# EAGLE schematic mppt (EAGLE 9.6.2)

## Sheet 1 of 2
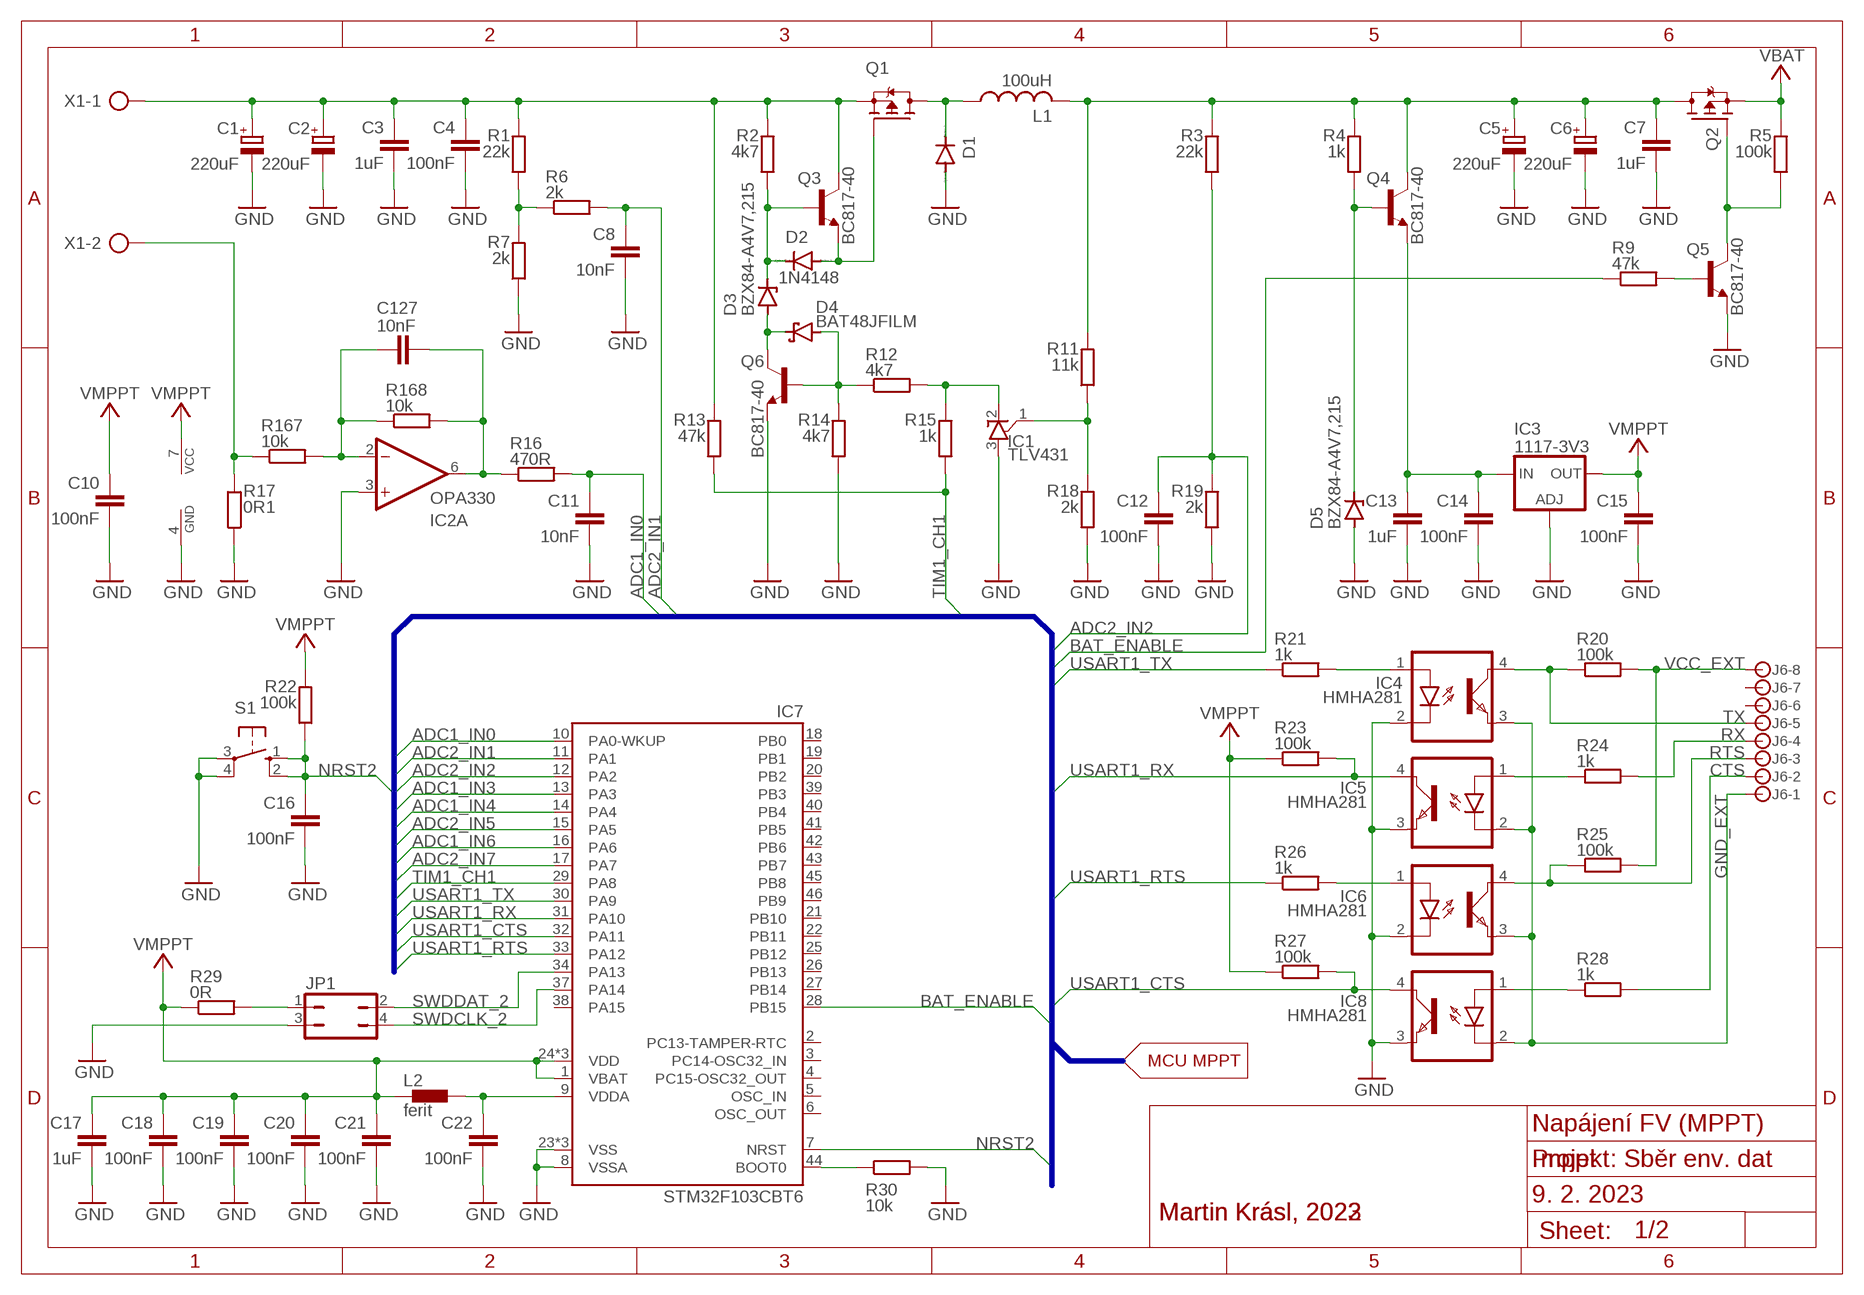
[diagram p0: schematic, sheet 1]

### Parts
C1  220uF  CPOL-EUG  [PANASONIC_G]
C2  220uF  CPOL-EUG  [PANASONIC_G]
C3  1uF  C-EUC0805  [C0805]
C4  100nF  C-EUC0402  [C0402]
C5  220uF  CPOL-EUG  [PANASONIC_G]
C6  220uF  CPOL-EUG  [PANASONIC_G]
C7  1uF  C-EUC0805  [C0805]
C8  10nF  C-EUC0402  [C0402]
C10  100nF  C-EUC0402  [C0402]
C11  10nF  C-EUC0402  [C0402]
C12  100nF  C-EUC0402  [C0402]
C13  1uF  C-EUC0805  [C0805]
C14  100nF  C-EUC0402  [C0402]
C15  100nF  C-EUC0402  [C0402]
C16  100nF  C-EUC0402  [C0402]
C17  1uF  C-EUC0805  [C0805]
C18  100nF  C-EUC0402  [C0402]
C19  100nF  C-EUC0402  [C0402]
C20  100nF  C-EUC0402  [C0402]
C21  100nF  C-EUC0402  [C0402]
C22  100nF  C-EUC0402  [C0402]
C127  10nF  C-EUC0402  [C0402]
D1  #?  1N4148  [SOD323]
D2  1N4148  [SOD323]
D3  BZX84-A4V7,215  ZENER-DIODESOT23  [SOT23]
D4  BAT48JFILM  BAT48  [SOD323]
D5  BZX84-A4V7,215  ZENER-DIODESOT23  [SOT23]
IC1  TLV431  [SOT23]
IC2  OPA330  OPA3  [SOIC-8]
IC3  1117-3V3  LD117AD2MTR  [D2PACK]
IC4  HMHA281  [SOIC127P680X239-4N]
IC5  HMHA281  [SOIC127P680X239-4N]
IC6  HMHA281  [SOIC127P680X239-4N]
IC7  STM32F103CBT6  [QFP50P900X900X160-48N]
IC8  HMHA281  [SOIC127P680X239-4N]
J6  JST-XH-8  [B8B-XH-A]
JP1  JP2Q  [JP2Q]
L1  100uH  L-USCEP125  [CEP125]
L2  ferit  BLM15HB121SN1  [0402]
Q1  #?  BSL207SP  [SC74_INFINEON]
Q2  #?  BSL207SP  [SC74_INFINEON]
Q3  BC817-40  BC817-16LT1SMD  [SOT23-BEC]
Q4  BC817-40  BC817-16LT1SMD  [SOT23-BEC]
Q5  BC817-40  BC817-16LT1SMD  [SOT23-BEC]
Q6  BC817-40  BC817-16LT1SMD  [SOT23-BEC]
R1  22k  R-EU_R0402  [R0402]
R2  4k7  R-EU_R0402  [R0402]
R3  22k  R-EU_R0402  [R0402]
R4  1k  R-EU_R0402  [R0402]
R5  100k  R-EU_R0402  [R0402]
R6  2k  R-EU_R0402  [R0402]
R7  2k  R-EU_R0402  [R0402]
R9  47k  R-EU_R0402  [R0402]
R11  11k  R-EU_R0402  [R0402]
R12  4k7  R-EU_R0402  [R0402]
R13  47k  R-EU_R0402  [R0402]
R14  4k7  R-EU_R0402  [R0402]
R15  1k  R-EU_R0402  [R0402]
R16  470R  R-EU_R0402  [R0402]
R17  0R1  R-EU_R0805  [R0805]
R18  2k  R-EU_R0402  [R0402]
R19  2k  R-EU_R0402  [R0402]
R20  100k  R-EU_R0402  [R0402]
R21  1k  R-EU_R0402  [R0402]
R22  100k  R-EU_R0402  [R0402]
R23  100k  R-EU_R0402  [R0402]
R24  1k  R-EU_R0402  [R0402]
R25  100k  R-EU_R0402  [R0402]
R26  1k  R-EU_R0402  [R0402]
R27  100k  R-EU_R0402  [R0402]
R28  1k  R-EU_R0402  [R0402]
R29  0R  R-EU_R0402  [R0402]
R30  10k  R-EU_R0402  [R0402]
R167  10k  R-EU_R0402  [R0402]
R168  10k  R-EU_R0402  [R0402]
S1  10-XX  [B3F-10XX]
X1  AK500/2  [AK500/2]

### Nets
ADC1_IN0: C11.1 IC7.10(PA0-WKUP) R16.2
ADC1_IN3: IC7.13(PA3) ; also sheet 2
ADC1_IN4: IC7.14(PA4) ; also sheet 2
ADC1_IN6: IC7.16(PA6) ; also sheet 2
ADC2_IN1: C8.1 IC7.11(PA1) R6.2
ADC2_IN2: C12.1 IC7.12(PA2) R3.1 R19.2
ADC2_IN5: IC7.15(PA5) ; also sheet 2
ADC2_IN7: IC7.17(PA7) ; also sheet 2
BAT_ENABLE: IC7.28(PB15) R9.1
CTS: J6.2 R28.2
GND: C1.- C2.- C3.2 C4.2 C5.- C6.- C7.2 C8.2 C10.2 C11.2 C12.2 C13.2 C14.2 C15.2 C16.2 C17.2 C18.2 C19.2 C20.2 C21.2 C22.2 D1.2(A) D5.1(A) IC1.3(A) IC2.3(A:+IN) IC2.4(P:GND) IC3.1(ADJ) IC4.2(K) IC5.3(E) IC6.2(K) IC7.8(VSSA) IC7.23(VSS) IC7.35(VSS) IC7.47(VSS) IC8.3(E) JP1.3 Q5.E Q6.E R7.1 R14.1 R17.1 R18.1 R19.1 R30.2 S1.3(P) S1.4(P1) ; also sheet 2
GND_EXT: IC4.3(E) IC5.2(K) IC6.3(E) IC8.2(K) J6.1
N$21: C127.1 IC2.2(A:-IN) R167.2 R168.1
N$22: C127.2 IC2.6(A:OUT) R16.1 R168.2
N$28: C13.1 C14.1 IC3.3(IN) Q4.E
N$67: C22.1 IC7.9(VDDA) L2.2
N$68: IC1.2(C) R12.2 R15.2
N$74: D5.3(C) Q4.B R4.1
N$75: Q5.B R9.2
N$79: R17.2 R167.1 X1.2
N$81: IC1.1(R) R11.1 R18.2
N$83: C5.+ C6.+ C7.1 L1.2 Q2.1(D) Q2.2(D) Q2.5(D) Q2.6(D) Q4.C R3.2 R4.2 R11.2
N$85: C1.+ C2.+ C3.1 C4.1 Q1.4(S) Q3.C R1.2 R2.2 R13.2 X1.1
N$86: D2.2(A) Q1.3(G) Q3.E
N$87: D2.1(C) D3.3(C) Q3.B R2.1
N$88: D3.1(A) D4.1(C) Q6.C
N$89: D4.2(A) Q6.B R12.1 R14.2
N$90: D1.1(C) L1.1 Q1.1(D) Q1.2(D) Q1.5(D) Q1.6(D)
N$93: Q2.3(G) Q5.C R5.1
N$96: R1.1 R6.1 R7.2
N$104: JP1.1 R29.2
N$106: IC7.44(BOOT0) R30.1
N$115: IC6.1(A) R26.2
N$118: IC4.1(A) R21.2
N$141: IC8.1(A) R28.1
N$143: IC5.1(A) R24.1
NRST2: C16.1 IC7.7(NRST) R22.1 S1.1(S) S1.2(S1)
RTS: IC6.4(C) J6.3 R25.1
RX: J6.4 R24.2
SWDCLK_2: IC7.37(PA14) JP1.4
SWDDAT_2: IC7.34(PA13) JP1.2
TIM1_CH1: IC7.29(PA8) R13.1 R15.1
TX: IC4.4(C) J6.5 R20.1
USART1_CTS: IC7.32(PA11) IC8.4(C) R27.2
USART1_RTS: IC7.33(PA12) R26.1
USART1_RX: IC5.4(C) IC7.31(PA10) R23.2
USART1_TX: IC7.30(PA9) R21.1
VBAT: Q2.4(S) R5.2 ; also sheet 2
VCC_EXT: J6.8 R20.2 R25.2
VMPPT: C10.1 C15.1 C17.1 C18.1 C19.1 C20.1 C21.1 IC2.7(P:VCC) IC3.2(OUT) IC7.1(VBAT) IC7.24(VDD) IC7.36(VDD) IC7.48(VDD) L2.1 R22.2 R23.1 R27.1 R29.1 ; also sheet 2
Unconnected: IC7.2(PC13-TAMPER-RTC) IC7.3(PC14-OSC32_IN) IC7.4(PC15-OSC32_OUT) IC7.5(OSC_IN) IC7.6(OSC_OUT) IC7.18(PB0) IC7.19(PB1) IC7.20(PB2) IC7.21(PB10) IC7.22(PB11) IC7.25(PB12) IC7.26(PB13) IC7.27(PB14) IC7.38(PA15) IC7.39(PB3) IC7.40(PB4) IC7.41(PB5) IC7.42(PB6) IC7.43(PB7) IC7.45(PB8) IC7.46(PB9) J6.6 J6.7

### Buses
ADC1_IN0,ADC1_IN3,ADC1_IN4,ADC1_IN6,ADC2_IN1,ADC2_IN2,ADC2_IN5,ADC2_IN7,BAT_ENABLE,NRST2,SYS_JTCK-SWCLK,SYS_JTMS-SWDIO,TIM1_CH1,USART1_CTS,USART1_RTS,USART1_RX,USART1_TX

### Notes on the sheet
- MCU MPPT
- Napájení FV (MPPT)
- Projekt: Sběr env. dat
- 9. 2. 2023
- Martin Krásl, 2022 | Martin Krásl, 2023

## Sheet 2 of 2
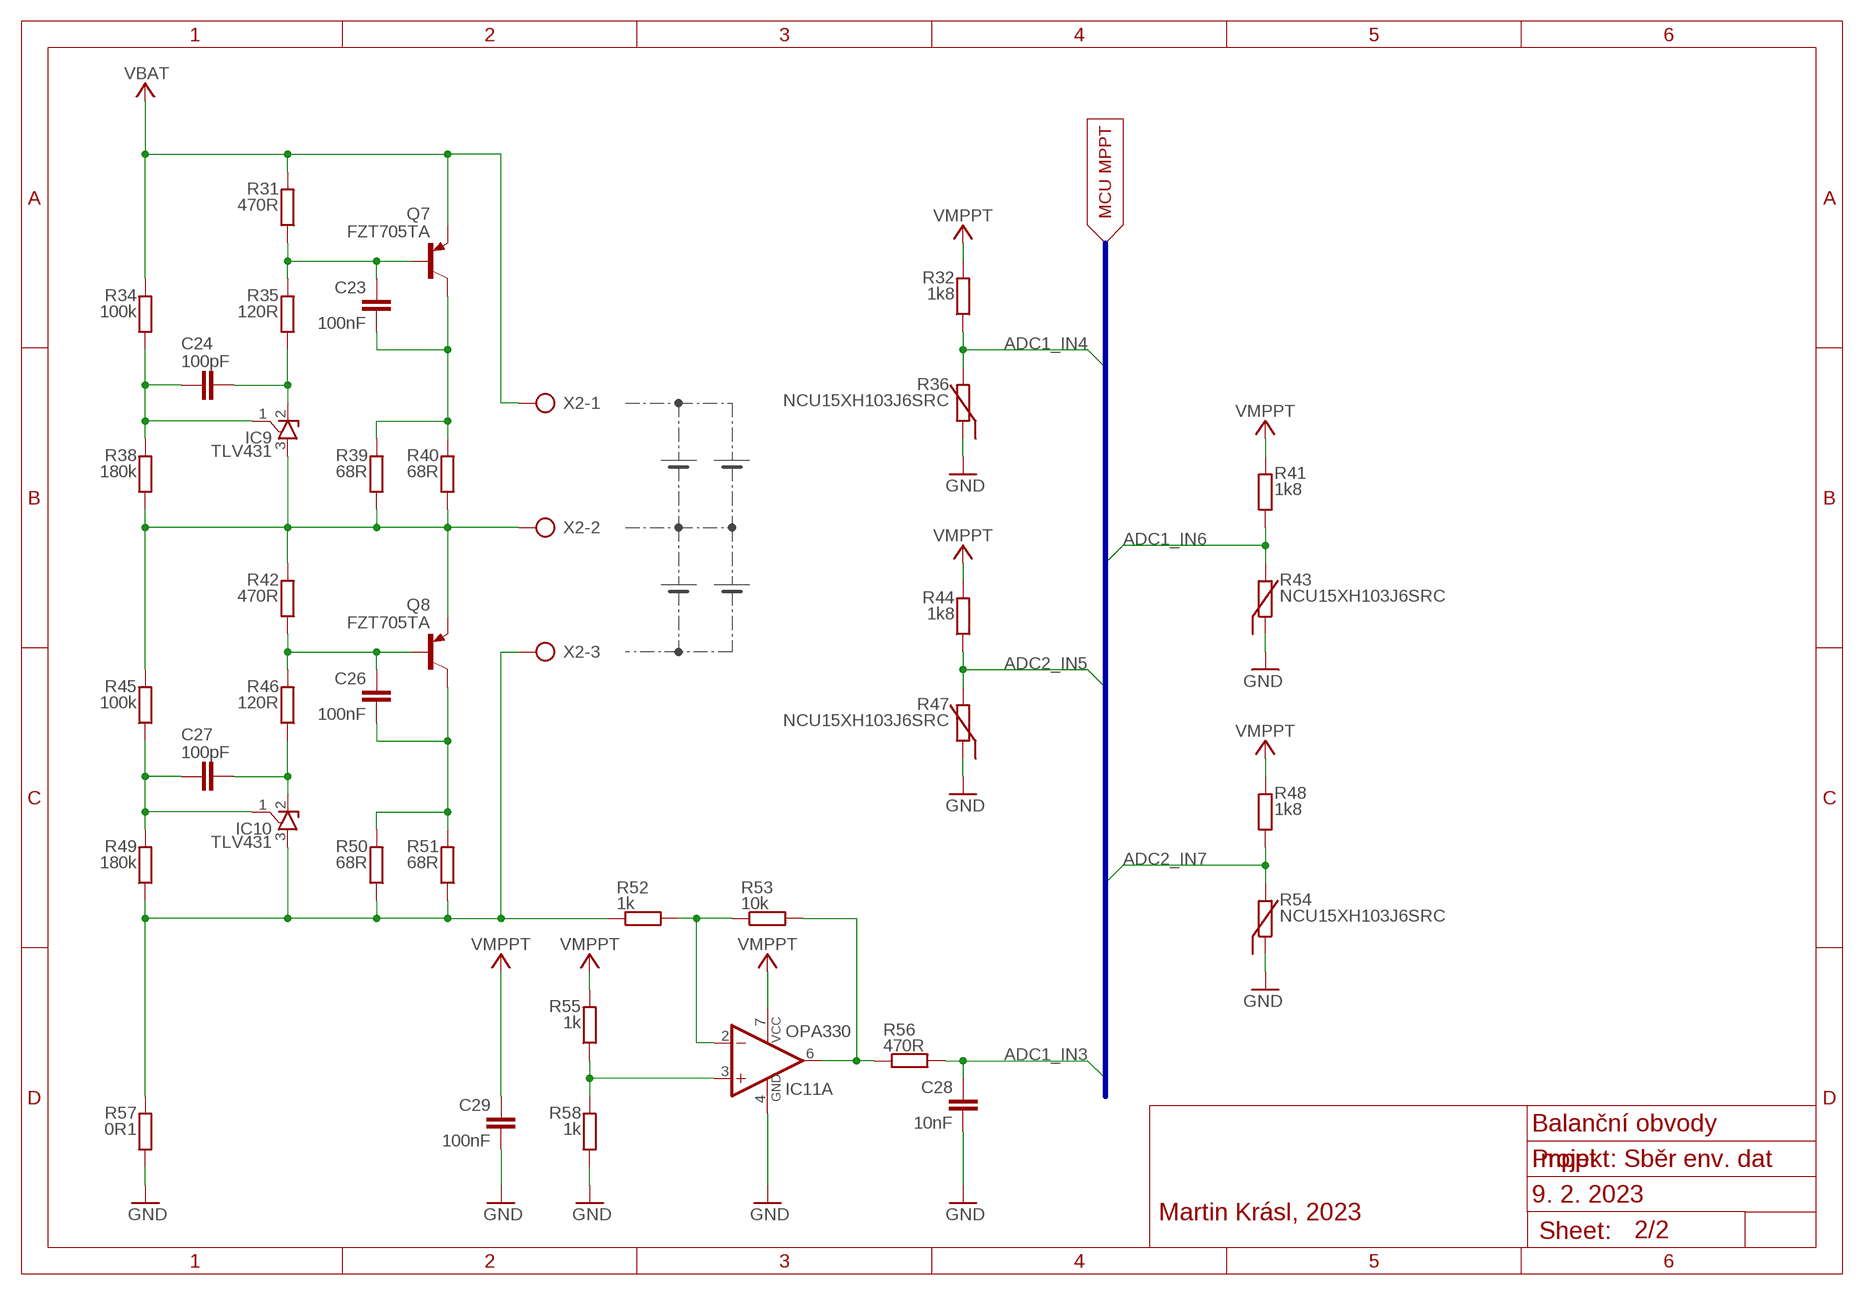
[diagram p1: schematic, sheet 2]

### Parts
C23  100nF  C-EUC0402  [C0402]
C24  100pF  C-EUC0402  [C0402]
C26  100nF  C-EUC0402  [C0402]
C27  100pF  C-EUC0402  [C0402]
C28  10nF  C-EUC0402  [C0402]
C29  100nF  C-EUC0402  [C0402]
IC9  TLV431  [SOT23]
IC10  TLV431  [SOT23]
IC11  OPA330  OPA3  [SOIC-8]
Q7  FZT705TA  FZT753SMD  [SOT223]
Q8  FZT705TA  FZT753SMD  [SOT223]
R31  470R  R-EU_R0402  [R0402]
R32  1k8  R-EU_R0402  [R0402]
R34  100k  R-EU_R0402  [R0402]
R35  120R  R-EU_R0402  [R0402]
R36  NCU15XH103J6SRC  [R0402]
R38  180k  R-EU_R0402  [R0402]
R39  68R  R-EU_R2512  [R2512]
R40  68R  R-EU_R2512  [R2512]
R41  1k8  R-EU_R0402  [R0402]
R42  470R  R-EU_R0402  [R0402]
R43  NCU15XH103J6SRC  [R0402]
R44  1k8  R-EU_R0402  [R0402]
R45  100k  R-EU_R0402  [R0402]
R46  120R  R-EU_R0402  [R0402]
R47  NCU15XH103J6SRC  [R0402]
R48  1k8  R-EU_R0402  [R0402]
R49  180k  R-EU_R0402  [R0402]
R50  68R  R-EU_R2512  [R2512]
R51  68R  R-EU_R2512  [R2512]
R52  1k  R-EU_R0402  [R0402]
R53  10k  R-EU_R0402  [R0402]
R54  NCU15XH103J6SRC  [R0402]
R55  1k  R-EU_R0402  [R0402]
R56  470R  R-EU_R0402  [R0402]
R57  0R1  R-EU_R0805  [R0805]
R58  1k  R-EU_R0402  [R0402]
X2  AK500/3  [AK500/3]

### Nets
ADC1_IN3: C28.1 R56.2 ; also sheet 1
ADC1_IN4: R32.1 R36.2 ; also sheet 1
ADC1_IN6: R41.1 R43.2 ; also sheet 1
ADC2_IN5: R44.1 R47.2 ; also sheet 1
ADC2_IN7: R48.1 R54.2 ; also sheet 1
GND: C28.2 C29.2 IC11.4(P:GND) R36.1 R43.1 R47.1 R54.1 R57.1 R58.1 ; also sheet 1
N$76: IC11.3(A:+IN) R55.1 R58.2
N$80: C23.2 Q7.2(C) Q7.4(C) R39.2 R40.2
N$100: IC9.3(A) Q8.3(E) R38.1 R39.1 R40.1 R42.2 R45.2 X2.2
N$102: C23.1 Q7.1(B) R31.1 R35.2
N$116: IC11.2(A:-IN) R52.2 R53.1
N$119: C24.2 IC9.2(C) R35.1
N$124: C24.1 IC9.1(R) R34.1 R38.2
N$129: C26.2 Q8.2(C) Q8.4(C) R50.2 R51.2
N$130: C26.1 Q8.1(B) R42.1 R46.2
N$132: C27.2 IC10.2(C) R46.1
N$134: C27.1 IC10.1(R) R45.1 R49.2
N$147: IC11.6(A:OUT) R53.2 R56.1
N$148: IC10.3(A) R49.1 R50.1 R51.1 R52.1 R57.2 X2.3
VBAT: Q7.3(E) R31.2 R34.2 X2.1 ; also sheet 1
VMPPT: C29.1 IC11.7(P:VCC) R32.2 R41.2 R44.2 R48.2 R55.2 ; also sheet 1

### Buses
ADC1_IN0,ADC1_IN3,ADC1_IN4,ADC1_IN6,ADC2_IN1,ADC2_IN2,ADC2_IN5,ADC2_IN7,BAT_ENABLE,NRST2,SYS_JTCK-SWCLK,SYS_JTMS-SWDIO,TIM1_CH1,USART1_CTS,USART1_RTS,USART1_RX,USART1_TX

### Notes on the sheet
- MCU MPPT
- Balanční obvody
- Projekt: Sběr env. dat
- 9. 2. 2023
- Martin Krásl, 2023

## Library data of the parts
C1 C2 C5 C6 = rcl:CPOL-EU: POLARIZED CAPACITOR, European symbol; SPICEPREFIX: C
C3 C4 C7 C8 C10-C24 C26-C29 C127 = rcl:C-EU: CAPACITOR, European symbol; SPICEPREFIX: C
D1 D2 = MKLIB:1N4148: DIODE high speed (Philips)
D3 D5 = diode:ZENER-DIODE: Z-Diode
D4 = MKLIB:BAT48: DIODE small signal diode
IC1 IC9 IC10 = MKLIB:TLV431
IC2 IC11 = MKLIB:OPA3*: Low Power Single Op Amp Source: http://cache.national.com/ds/LM/LM321.pdf
IC3 = v-reg:LD117A?*: Low drop fixed and adjustable positive voltage regulators 1 A Source: http://www.st.com/stonline/products/literature/ds/7194/ld1117axx.pdf
IC4-IC6 IC8 = HMHA281:HMHA281: Transistor Output Optocouplers Optocoupler Phototransistor Source: Datasheet <https://www.onsemi.com/pub/Collateral/HMHA2801B-D.PDF>; ARROW_PART_NUMBER: HMHA281; ARROW_PRICE-STOCK: https://www.arrow.com/en/products/hmha281/on-semiconductor?region=nac; DESCRIPTION: Transistor Output Optocouplers Optocoupler Phototransistor; HEIGHT: 2.39mm; MANUFACTURER_NAME: onsemi; MANUFACTURER_PART_NUMBER: HMHA281; MOUSER_PART_NUMBER: 512-HMHA281; MOUSER_PRICE-STOCK: https://www.mouser.co.uk/ProductDetail/ON-Semiconductor-Fairchild/HMHA281/?qs=GcrAnsq4Ss6dlsByHYQYlQ%3D%3D
IC7 = STM32F103CBT6:STM32F103CBT6: STM32F103CBT6, 32 bit ARM Cortex M3 , 72MHz, 128 kB ROM , 20 kB RAM USB CAN I2C, 48 LQFP Source: Datasheet <http://www.st.com/st-web-ui/static/active/en/resource/technical/document/datasheet/CD00161566.pdf>; ARROW_PART_NUMBER: STM32F103CBT6; ARROW_PRICE-STOCK: https://www.arrow.com/en/products/stm32f103cbt6/stmicroelectronics?region=europe; DESCRIPTION: STM32F103CBT6, 32 bit ARM Cortex M3 , 72MHz, 128 kB ROM , 20 kB RAM USB CAN I2C, 48 LQFP; HEIGHT: 1.6mm; MANUFACTURER_NAME: STMicroelectronics; MANUFACTURER_PART_NUMBER: STM32F103CBT6; MOUSER_PART_NUMBER: 511-STM32F103CBT6; MOUSER_PRICE-STOCK: https://www.mouser.co.uk/ProductDetail/STMicroelectronics/STM32F103CBT6?qs=WxFF5lh7QM3goh6GV5Ogig%3D%3D
J6 = con-JST-XH:JST-XH-8: JST-XH 4-way vertical TH; MF: JST; MPN: B8B-XH-A
JP1 = jumper:JP2Q: JUMPER
L1 = rcl:L-US: INDUCTOR, American symbol; SPICEPREFIX: L
L2 = inductors:BLM15H: EMIFIL (R) Chip Ferrite Bead for GHz Noise Source: http://www.murata.com/ Ferrite Bead BLM15H.pdf
Q1 Q2 = transistor-fet:BSL207SP: OptiMOS(R)-P Small-Signal-Transistor P-Channel, Enhancement mode, Super Logic Level (2.5 V rated) Source: http://www.infineon.com/upload/Document/BSL207SP_Rev2.01.pdf
Q3-Q6 = transistor-npn:BC817*: NPN Transistor
Q7 Q8 = transistor-pnp:FZT753SMD: PNP Transistor
R1-R7 R9 R11-R32 R34 R35 R38-R42 R44-R46 R48-R53 R55-R58 R167 R168 = rcl:R-EU_: RESISTOR, European symbol; SPICEPREFIX: R
R36 R43 R47 R54 = MKLIB:NCU15XH103J6SRC
S1 = switch-omron:10-XX: OMRON SWITCH; MPN: B3F-1000; OC_FARNELL: 176432; OC_NEWARK: 36M3542
X1 = con-ptr500:AK500/2: CONNECTOR; OC_FARNELL: unknown; OC_NEWARK: unknown
X2 = con-ptr500:AK500/3: CONNECTOR; OC_FARNELL: unknown; OC_NEWARK: unknown

## Net classes
0 default: width 0.203 mm, clearance 0.305 mm